# Altium project PCB_Project.PrjPcb
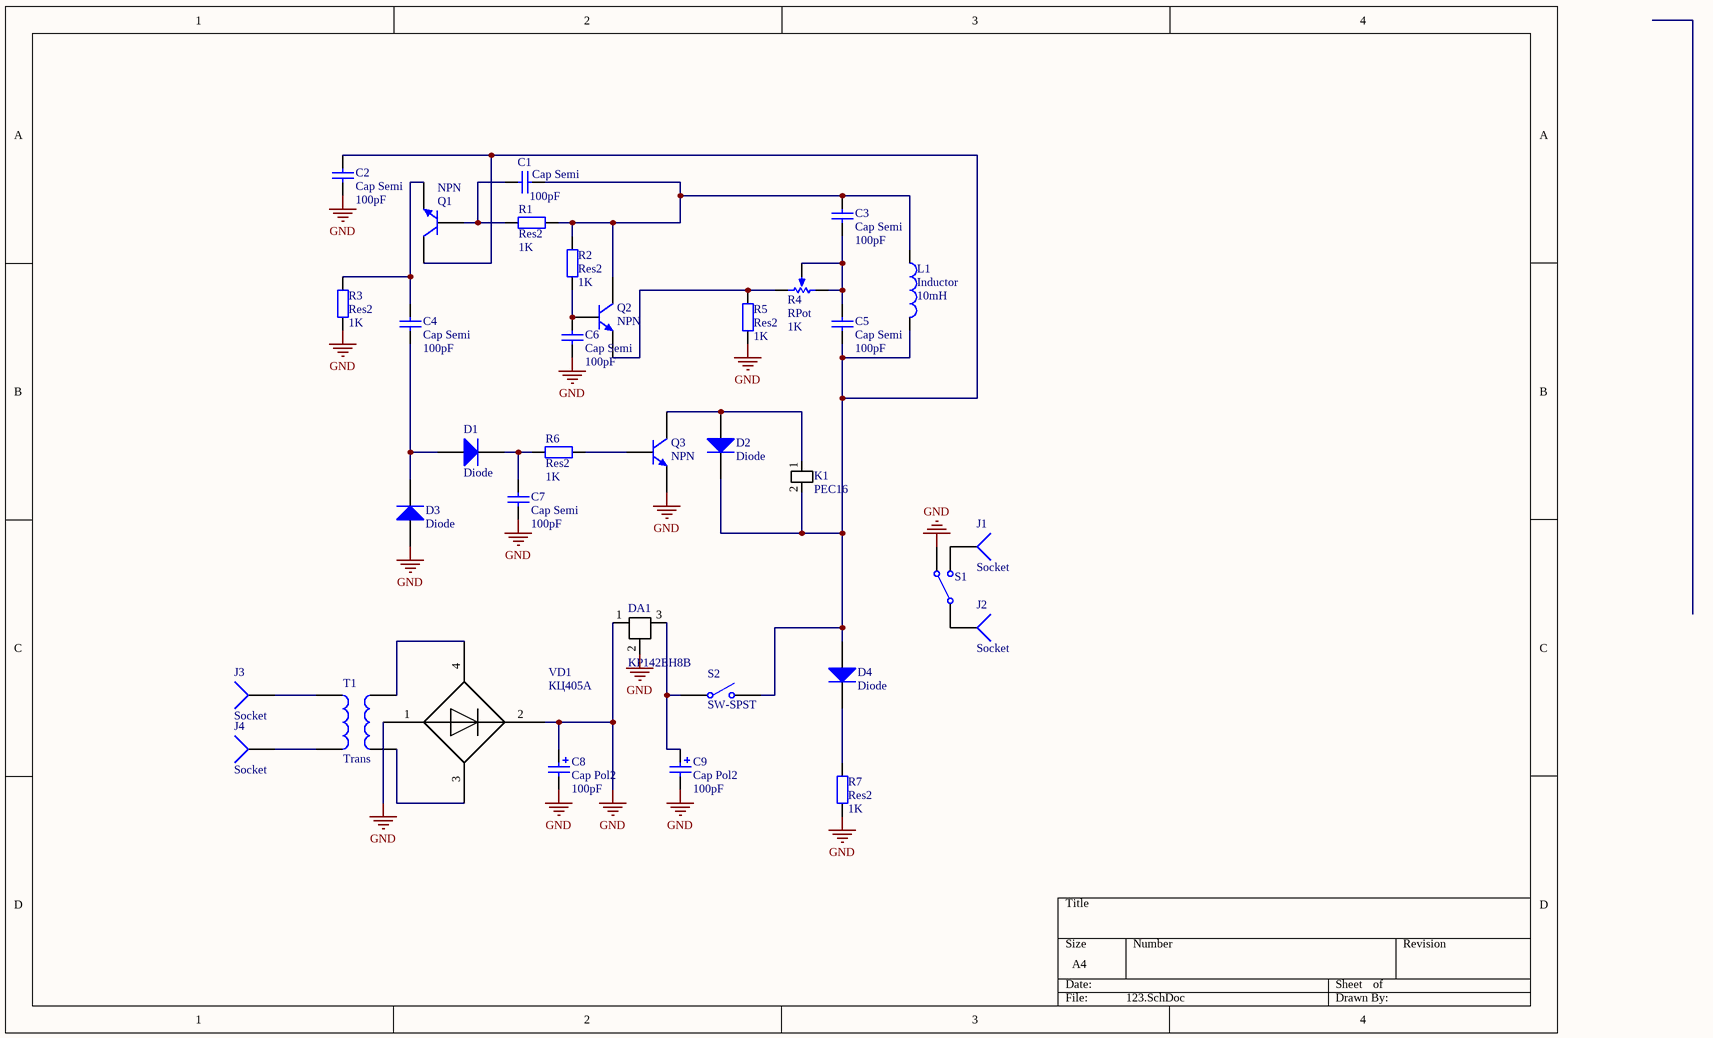
[diagram p0: 123.SchDoc]
1 sheet, 34 parts. Net scope: global (net labels, ports and power ports of the same name join across sheets).
Board file: 123.PcbDoc

## Sheet 123.SchDoc
size A4; SheetNumber: 1; SheetTotal: 1; SPICEModelCacheVBECNPNM: <root> / <DocumentId>VBECNPNM</DocumentId> / </root>

### Parts
C1  Cap Semi  value 100pF  [C1206]
C2  Cap Semi  value 100pF  [C1206]
C3  Cap Semi  value 100pF  [C1206]
C4  Cap Semi  value 100pF  [C1206]
C5  Cap Semi  value 100pF  [C1206]
C6  Cap Semi  value 100pF  [C1206]
C7  Cap Semi  value 100pF  [C1206]
C8  Cap Pol2  value 100pF  [POLAR0.8]
C9  Cap Pol2  value 100pF  [POLAR0.8]
D1  Diode  [SMC]
D2  Diode  [SMC]
D3  Diode  [SMC]
D4  Diode  [SMC]
DA1  KP142EH8B  [PCBComponent_1 - duplicate]
J1  Socket  [PIN1]
J2  Socket  [PIN1]
J3  Socket  [PIN1]
J4  Socket  [PIN1]
K1  PEC16  [PCBComponent_1 - duplicate1]
L1  Inductor  value 10mH  [0402-A]
Q1  NPN  [TO-226-AA]
Q2  NPN  [TO-226-AA]
Q3  NPN  [TO-226-AA]
R1  Res2  value 1K  [AXIAL-0.4]
R2  Res2  value 1K  [AXIAL-0.4]
R3  Res2  value 1K  [AXIAL-0.4]
R4  RPot  value 1K  [VR5]
R5  Res2  value 1K  [AXIAL-0.4]
R6  Res2  value 1K  [AXIAL-0.4]
R7  Res2  value 1K  [AXIAL-0.4]
S1  Single-Pole, Double-Throw Switch  (value not drawn)
S2  SW-SPST  [SPST-2]
T1  Trans  [TRANS]
VD1  КЦ405A  [PCBComponent_1]

### Nets
GND: C2.2 C6.2 C7.2 C8.1 C8.2 C9.2 D3.1(A) DA1.1 DA1.2 Q3.3(E) R3.1 R5.2 R7.1 S1.3 VD1.1 VD1.2
NetC1_1: C1.1 Q1.2(B) R1.2
NetC1_2: C1.2 C3.1 L1.1 Q2.1(C) R1.1 R2.2
NetC2_1: C2.1 C5.2 D2.2(K) D4.1(A) K1.2 L1.2 Q1.1(C) S2.2(NO)
NetC3_2: C3.2 C5.1 R4.1(TOP) R4.3(TAP)
NetC4_1: C4.1 Q1.3(E) R3.2
NetC4_2: C4.2 D1.1(A) D3.2(K)
NetC6_1: C6.1 Q2.2(B) R2.1
NetC7_1: C7.1 D1.2(K) R6.2
NetC9_1: C9.1 DA1.3 S2.1(COMMON)
NetD2_1: D2.1(A) K1.1 Q3.1(C)
NetD4_2: D4.2(K) R7.2
NetJ1_1: J1.1 S1.2
NetJ2_1: J2.1 S1.1
NetJ3_1: J3.1 T1.1
NetJ4_1: J4.1 T1.2
NetQ2_3: Q2.3(E) R4.2(BOT) R5.1
NetQ3_2: Q3.2(B) R6.1
NetT1_3: T1.3 VD1.4
NetT1_4: T1.4 VD1.3

### Library data of the parts
C1-C7 = Cap Semi: Capacitor (Semiconductor SIM Model); Published: 8-Jun-2000; LatestRevisionDate: 29-May-2009; LatestRevisionNote: IPC-7351 Footprint Added.; PackageReference: C1206; Publisher: Altium Limited; PackageDescription: Chip Capacitor
C8 C9 = Cap Pol2: Polarized Capacitor (Axial); Published: 8-Jun-2000; LatestRevisionDate: 17-Jul-2002; LatestRevisionNote: Re-released for DXP Platform.; PackageReference: POLAR0.8; Publisher: Altium Limited; PackageDescription: Polarized Capacitor; 2 Leads
D1-D4 = Diode: Default Diode; Published: 8-Jun-2000; LatestRevisionDate: 17-Jul-2002; LatestRevisionNote: Re-released for DXP Platform.; PackageVersion: Sep-1996; PackageReference: SMC; Publisher: Altium Limited; PackageDescription: DO-214-AB/SMC; 2 C-Bend Leads; Body 7.9 x 5.9 mm, inc. leads (LxW); Code_JEDEC: DO-214-AB
L1 = Inductor: Code_IEC: 1005; Published: 8-Jun-2000; LatestRevisionDate: 29-May-2009; LatestRevisionNote: IPC-7351 Footprint Added.; PackageReference: 0402-A; Publisher: Altium Limited; PackageDescription: Chip Inductor; Code_JEITA: 0402
Q1-Q3 = NPN: NPN Bipolar Transistor; Published: 8-Jun-2000; LatestRevisionDate: 17-Jul-2002; LatestRevisionNote: Re-released for DXP Platform.; PackageReference: TO-226-AA; Publisher: Altium Limited; PackageDescription: TO, Flat Index; 3 In-Line, Axial Leads; Body Dia. 4.8mm; Leads 0.55 x 0.51 mm (max); Code_JEDEC: TO-226-AA
R1-R3 R5-R7 = Res2: Resistor; Published: 8-Jun-2000; LatestRevisionDate: 17-Jul-2002; LatestRevisionNote: Re-released for DXP Platform.; PackageReference: AXIAL-0.4; Publisher: Altium Limited; PackageDescription: Axial Device, Thru-Hole; 2 Leads; 0.4 in Pin Spacing
R4 = RPot: Potentiometer; Sim Note: Enter the Resistance value and the set point into parameter fields.; Set Position: 0.5; Published: 8-Jun-2000; LatestRevisionDate: 17-Jul-2002; LatestRevisionNote: Re-released for DXP Platform.; PackageReference: VR5; Publisher: Altium Limited; PackageDescription: Variable Resistor, Thru-Hole; 3 Leads
S1 = SPDT SW: nodeUP_closed: 1; Rclosed: 1m; Ropen: 1Meg; SimulationGenericComponent: True
S2 = SW-SPST: Single-Pole, Single-Throw Switch; Published: 24-Mar-1999; LatestRevisionDate: 17-Jul-2002; LatestRevisionNote: Re-released for DXP Platform.; PackageReference: SPST-2; Publisher: Altium Limited; PackageDescription: Switch; 2 Leads
T1 = Trans: Transformer; Published: 24-Mar-1999; LatestRevisionDate: 08-Jul-2005; LatestRevisionNote: Mech Layer 1 removed.; PackageReference: TRANS; Publisher: Altium Limited; PackageDescription: Transformer; 4 Leads
J1-J4 = Socket: LatestRevisionDate: 17-Jul-2002; LatestRevisionNote: Re-released for DXP Platform.; Publisher: Altium Limited